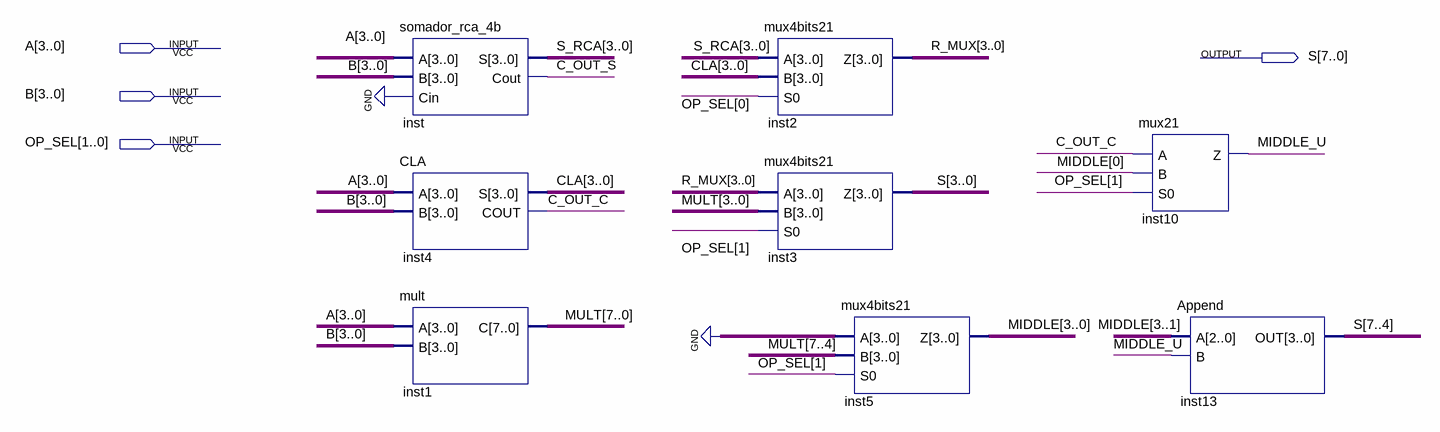
[diagram p0: schematic sheet]
// Quartus schematic ULA.bdf as structural Verilog: 8 symbols, 4 pins
module ULA (
  input  [3:0] A,
  input  [3:0] B,
  input  [1:0] OP_SEL,
  output [7:0] S
);

  wire C_OUT_C, C_OUT_S, MIDDLE_U;
  wire [3:0] CLA, MIDDLE, R_MUX, S_RCA;
  wire [7:0] MULT;

  somador_rca_4b inst (.A(A), .B(B), .Cin(1'b0), .S(S_RCA), .Cout(C_OUT_S));
  CLA inst4 (.A(A), .B(B), .S(CLA), .COUT(C_OUT_C));
  mult inst1 (.A(A), .B(B), .C(MULT));
  mux4bits21 inst2 (.A(S_RCA), .B(CLA), .S0(OP_SEL[0]), .Z(R_MUX));
  mux4bits21 inst3 (.A(R_MUX), .B(MULT[3:0]), .S0(OP_SEL[1]), .Z(S[3:0]));
  mux4bits21 inst5 (.A(4'b0000), .B(MULT[7:4]), .S0(OP_SEL[1]), .Z(MIDDLE));
  mux21 inst10 (.A(C_OUT_C), .B(MIDDLE[0]), .S0(OP_SEL[1]), .Z(MIDDLE_U));
  Append inst13 (.A(MIDDLE[3:1]), .B(MIDDLE_U), .OUT(S[7:4]));
endmodule
